# Altium schematic sheet FPGA_MIO.SchDoc
size A4; SheetNumber: 1; SheetTotal: 1
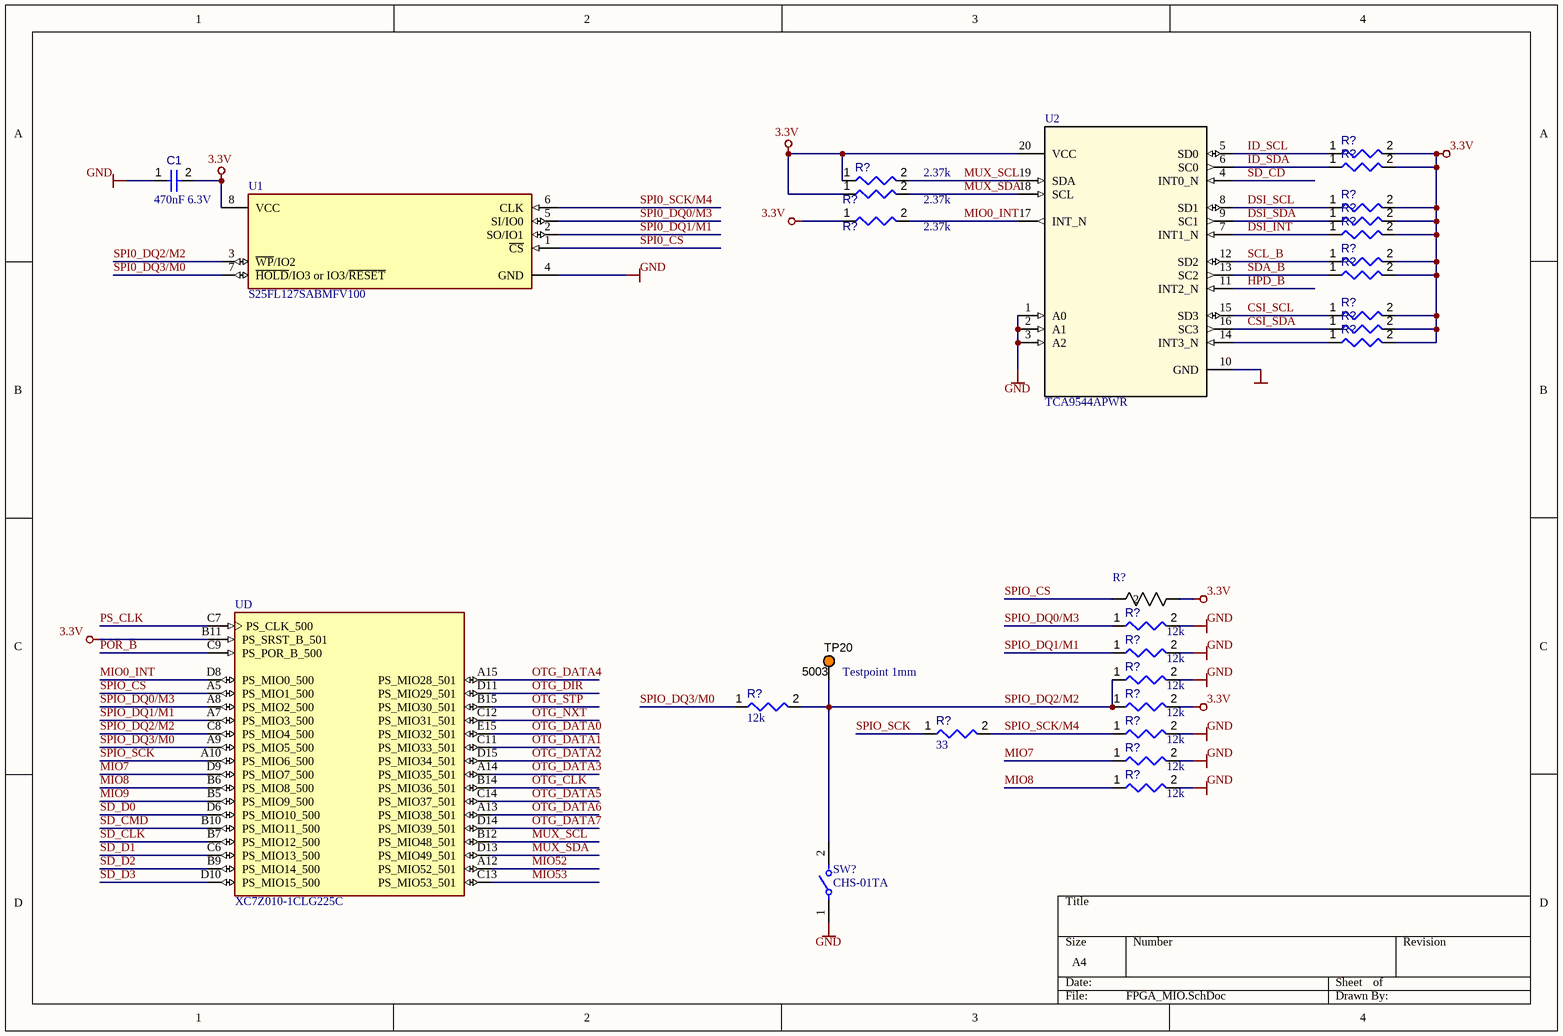
[diagram p0: FPGA_MIO.SchDoc]

## Parts
(Parts that share a designator on the sheet are numbered #1, #2 ... from top to bottom, then left to right.)
C1  value 470nF 6.3V  [CAPC0603(1608)100_L]  (hidden comment: Capacitor 470nF +/-20% 25V 0603)
R?#1  2D37KR2F  [RESC0402(1005)_L]  (value not drawn)
R?#2  2D37KR2F  [RESC0402(1005)_L]  (value not drawn)
R?#3  value 2.37k  [RESC0402(1005)_L]  (hidden comment: 2D37KR2F)
R?#4  value 2.37k  [RESC0402(1005)_L]  (hidden comment: 2D37KR2F)
R?#5  2D37KR2F  [RESC0402(1005)_L]  (value not drawn)
R?#6  value 2.37k  [RESC0402(1005)_L]  (hidden comment: 2D37KR2F)
R?#7  2D37KR2F  [RESC0402(1005)_L]  (value not drawn)
R?#8  2D37KR2F  [RESC0402(1005)_L]  (value not drawn)
R?#9  2D37KR2F  [RESC0402(1005)_L]  (value not drawn)
R?#10  2D37KR2F  [RESC0402(1005)_L]  (value not drawn)
R?#11  2D37KR2F  [RESC0402(1005)_L]  (value not drawn)
R?#12  2D37KR2F  [RESC0402(1005)_L]  (value not drawn)
R?#13  2D37KR2F  [RESC0402(1005)_L]  (value not drawn)
R?#14  H81K43BYA  [RES_H8_TYCO_TYC]  (value not drawn)
R?#15  value 12k  [RESC0402(1005)_L]  (hidden comment: Resistor 12K  +/-1 % 0402 63 mW)
R?#16  value 12k  [RESC0402(1005)_L]  (hidden comment: Resistor 12K  +/-1 % 0402 63 mW)
R?#17  value 12k  [RESC0402(1005)_L]  (hidden comment: Resistor 12K  +/-1 % 0402 63 mW)
R?#18  value 12k  [RESC0402(1005)_L]  (hidden comment: Resistor 12K  +/-1 % 0402 63 mW)
R?#19  value 12k  [RESC0402(1005)_L]  (hidden comment: Resistor 12K  +/-1 % 0402 63 mW)
R?#20  value 33  [RESC1005X40X25ML10T10]  (hidden comment: Resistor 33R +/-1% 0402 63 mW)
R?#21  value 12k  [RESC0402(1005)_L]  (hidden comment: Resistor 12K  +/-1 % 0402 63 mW)
R?#22  value 12k  [RESC0402(1005)_L]  (hidden comment: Resistor 12K  +/-1 % 0402 63 mW)
R?#23  value 12k  [RESC0402(1005)_L]  (hidden comment: Resistor 12K  +/-1 % 0402 63 mW)
SW?  CHS-01TA  [FP-CHS-01TA-MFG]
TP20  5003  [KSTN-5003]
U  XC7Z010-1CLG225C  [BGA225C80P15X15_1300X1300X150]  (part D of 6)
U1  S25FL127SABMFV100  [FP-PG-DSO-8-IPC_A]
U2  TCA9544APWR  [PW0020A_N]

## Nets
GND: C1.1 C1.2 R?#1.2 R?#2.2 R?#3.1 R?#4.1 R?#5.2 R?#6.1 R?#7.2 R?#8.2 R?#9.2 R?#10.2 R?#11.2 R?#12.2 R?#13.2 R?#14.1 R?#15.2 R?#16.2 R?#17.2 R?#19.2 R?#21.2 R?#22.2 R?#23.2 SW?.1 U.B11(PS_SRST_B_501) U1.4(GND) U1.8(VCC) U2.1(A0) U2.2(A1) U2.3(A2) U2.10(GND) U2.20(VCC)
CSI_SCL: R?#11.1 U2.15(SD3)
CSI_SDA: R?#12.1 U2.16(SC3)
DSI_INT: R?#8.1 U2.7(INT1_N)
DSI_SCL: R?#5.1 U2.8(SD1)
DSI_SDA: R?#7.1 U2.9(SC1)
HPD_B: U2.11(INT2_N)
ID_SCL: R?#1.1 U2.5(SD0)
ID_SDA: R?#2.1 U2.6(SC0)
MIO0_INT: R?#6.2 U.D8(PS_MIO0_500) U2.17(INT_N)
MIO7: R?#22.1 U.D9(PS_MIO7_500)
MIO8: R?#23.1 U.B6(PS_MIO8_500)
MIO9: U.B5(PS_MIO9_500)
MIO52: U.A12(PS_MIO52_501)
MIO53: U.C13(PS_MIO53_501)
MUX_SCL: R?#3.2 U.B12(PS_MIO48_501) U2.19(SDA)
MUX_SDA: R?#4.2 U.D13(PS_MIO49_501) U2.18(SCL)
OTG_CLK: U.B14(PS_MIO36_501)
OTG_DATA0: U.E15(PS_MIO32_501)
OTG_DATA1: U.C11(PS_MIO33_501)
OTG_DATA2: U.D15(PS_MIO34_501)
OTG_DATA3: U.A14(PS_MIO35_501)
OTG_DATA4: U.A15(PS_MIO28_501)
OTG_DATA5: U.C14(PS_MIO37_501)
OTG_DATA6: U.A13(PS_MIO38_501)
OTG_DATA7: U.D14(PS_MIO39_501)
OTG_DIR: U.D11(PS_MIO29_501)
OTG_NXT: U.C12(PS_MIO31_501)
OTG_STP: U.B15(PS_MIO30_501)
POR_B: U.C9(PS_POR_B_500)
PS_CLK: U.C7(PS_CLK_500)
SCL_B: R?#9.1 U2.12(SD2)
SD_CD: U2.4(INT0_N)
SD_CLK: U.B7(PS_MIO12_500)
SD_CMD: U.B10(PS_MIO11_500)
SD_D0: U.D6(PS_MIO10_500)
SD_D1: U.C6(PS_MIO13_500)
SD_D2: U.B9(PS_MIO14_500)
SD_D3: U.D10(PS_MIO15_500)
SDA_B: R?#10.1 U2.13(SC2)
SPI0_CS: U1.1(~{CS})
SPI0_DQ0/M3: U1.5(SI/IO0)
SPI0_DQ1/M1: U1.2(SO/IO1)
SPI0_DQ2/M2: U1.3(~{WP}/IO2)
SPI0_DQ3/M0: U1.7(~{HOLD}/IO3_or_IO3/~{RESET})
SPI0_SCK/M4: U1.6(CLK)
SPIO_CS: R?#14.2 U.A5(PS_MIO1_500)
SPIO_DQ0/M3: R?#15.1 U.A8(PS_MIO2_500)
SPIO_DQ1/M1: R?#16.1 U.A7(PS_MIO3_500)
SPIO_DQ2/M2: R?#17.1 R?#18.2 R?#19.1 SW?.2 TP20.1 U.C8(PS_MIO4_500)
SPIO_DQ3/M0: R?#18.1 U.A9(PS_MIO5_500)
SPIO_SCK: R?#20.1 U.A10(PS_MIO6_500)
SPIO_SCK/M4: R?#20.2 R?#21.1
NetR?#13_1: R?#13.1 U2.14(INT3_N)

## Notes on the sheet
- (near TP20) Testpoint 1mm
- Labels drawn without touching a wire or pin: 3.3V, GND

## Library data of the parts
C1 = CMP-001-00077-3: Chip Capacitor, 470nF +/-20%, 25V, 0603, Thickness 1 mm; Tolerance: 10%; Max Operating Temperature: 85°C; Voltage Rating: 25V; Pins: 2; Case/Package: 0603; Mounting Technology: SMT; Min Operating Temperature: -55°C
R?#1-R?#13 = CMP-009-00089-2: 2K37 0.063W 1% 0402 (1005 Metric)  SMD; Power: 63mW; Pins: 2; Tolerance: 1%; Case/Package: 0402; Mounting Technology: SMT
R?#14 = CMP-009-00179-1: H8 1K43 0.1% 15PPM; Manufacturer_Name: TE Connectivity; Datasheet: https://www.te.com/commerce/DocumentDelivery/DDEController?Action=srchrtrv&DocNm=1773230&DocType=Data+Sheet&DocLang=English&PartCntxt=1-1879664-0&DocFormat=pdf; Source: H81K43BYA.SchLib; Copyright: Copyright (C) 2025 Ultra Librarian. All rights reserved.; Manufacturer_Part_Number: H81K43BYA; Design Item ID: H81K43BYA
R?#15-R?#19 R?#21-R?#23 = CMP-009-00173-3: Chip Resistor, 12 kOhms, +/-1 %, 63 mW, -55 to 155 degC, 0402; Power: 63mW; Tolerance: 1%; Max Operating Temperature: 155°C; Min Operating Temperature: -55°C; Case/Package: 0402; Pins: 2
R?#20 = CMP-009-00029-5: Chip Resistor, 33 Ohm, +/- 1%, 0.063 W, -55 to 155 degC, 0402 (1005 Metric); Power: 63mW; Pins: 2; Mounting Technology: SM; Min Operating Temperature: -55°C; Tolerance: 1%; Max Operating Temperature: 155°C; RoHS Compliant: True; Case/Package: 0402
SW? = CMP-71740-000003-1: SWITCH SLIDE DIP SPST 100MA 6V; Manufacturer: Nidec Copal Electronics; Contact Resistance: 50mΩ; Standoff Height: 0mm; Number Of Circuits: 1; Electromechanical Life: 2000Cycles; Device Class L1: Electromechanical; Device Class L2: Switches; Category: Switch; Temperature Range Low: -40°C; Device Class L3: DIP Switches; Height: 2.5mm; Lead Free: Yes; Octopart: https://octopart.com/chs-01ta-nidec+copal-52304644; Throw Configuration: SPST; Package: CHS-01TA; Voltage Rating Dc: 6V; Digikey Description: SWITCH SLIDE DIP SPST 100MA 6V; Mount: Surface Mount; Automotive: No; Contact Current Rating: 100mA; ComponentLink2URL: https://www.nidec-copal-electronics.com/e/catalog/switch/chs.pdf; ComponentLink2Description: Datasheet; Temperature: -40°C to +85°C; Temperature Range High: +85°C; RoHS: TRUE; Manufacturer Part Number: CHS-01TA
TP20 = CMP-002-00037-2: Test Point, Orange, Height 4.6 mm, Tail Length 3 mm, 1-Pin THD, RoHS; Manufacturer: Keystone; Colour: Orange; Packaging: Bulk; Package Description: 1-Pin Through Hole Device, Dia 2.54 mm; Pins: 1; Package Reference: 5003; Datasheet Version: Jun-15; Case/Package: 5003; Mounting Technology: TH; Connector Type: TestPoint; Diameter: 2.54mm; Contact Material: Bronze; Datasheet URL: http://keyelco.com/userAssets/file/M65p56.pdf; Manufacturer URL: http://www.keyelco.com/; Package Quantity: 10; Contact Plating: Tin; RoHS Compliant: True
U = CMP-049-000000-1: Dual ARMÂ® CortexÂ®-A9 MPCoreâ„¢ with CoreSightâ„¢ System On Chip _SOC_ IC ZynqÂ®-7000 Artixâ„¢-7 FPGA, 28K Logic Cells 667MHz 225-CSPBGA _13x13_; MF: Xilinx Inc.; Digi-Key_Part_Number: 122-1855-ND; Component Type: Standard; SnapEDA_Link: https://www.snapeda.com/parts/XC7Z010-1CLG225C/Xilinx%20Inc./view-part/45778/?ref=snap; Value: *; Package: CSPBGA-225 Xilinx; MP: XC7Z010-1CLG225C; Design Item ID: XC7Z010-1CLG225C; Source: SnapEDAsch.SchLib; Digi-Key_Purchase_URL: https://www.digikey.by/product-detail/en/xilinx-inc/XC7Z010-1CLG225C/122-1855-ND/3925788?utm_source=snapeda&utm_medium=aggregator&utm_campaign=symbol; Pin Count: 225
U1 = CMP-32847-000085-1: IC FLASH 128MBIT SPI/QUAD 8SOIC
U2 = CMP-047-000000-1: 4-channel 1.65- to 5.5-V I2C/SMBus multiplexer with interrupt & voltage translation 20-TSSOP -40 to 85; Manufacturer_Name: Texas Instruments; CompType: IC; MountType: SMT; Copyright: Copyright (C) 2025 Ultra Librarian. All rights reserved.; RoHS: Y; RefDes: RefDes; SymbolVerison: 2015-05-04; TYPE: TYPE; Datasheet: https://www.ti.com/lit/gpn/tca9544a; PartNumber: TCA9544APWR; Manufacturer_Part_Number: TCA9544APWR; Source: TCA9544APWR.SchLib; PackageReference: PW0020A; Design Item ID: TCA9544APWR; Manufacturer: Texas Instruments